# EAGLE design WS2812MATRIX (EAGLE 9.0.0)
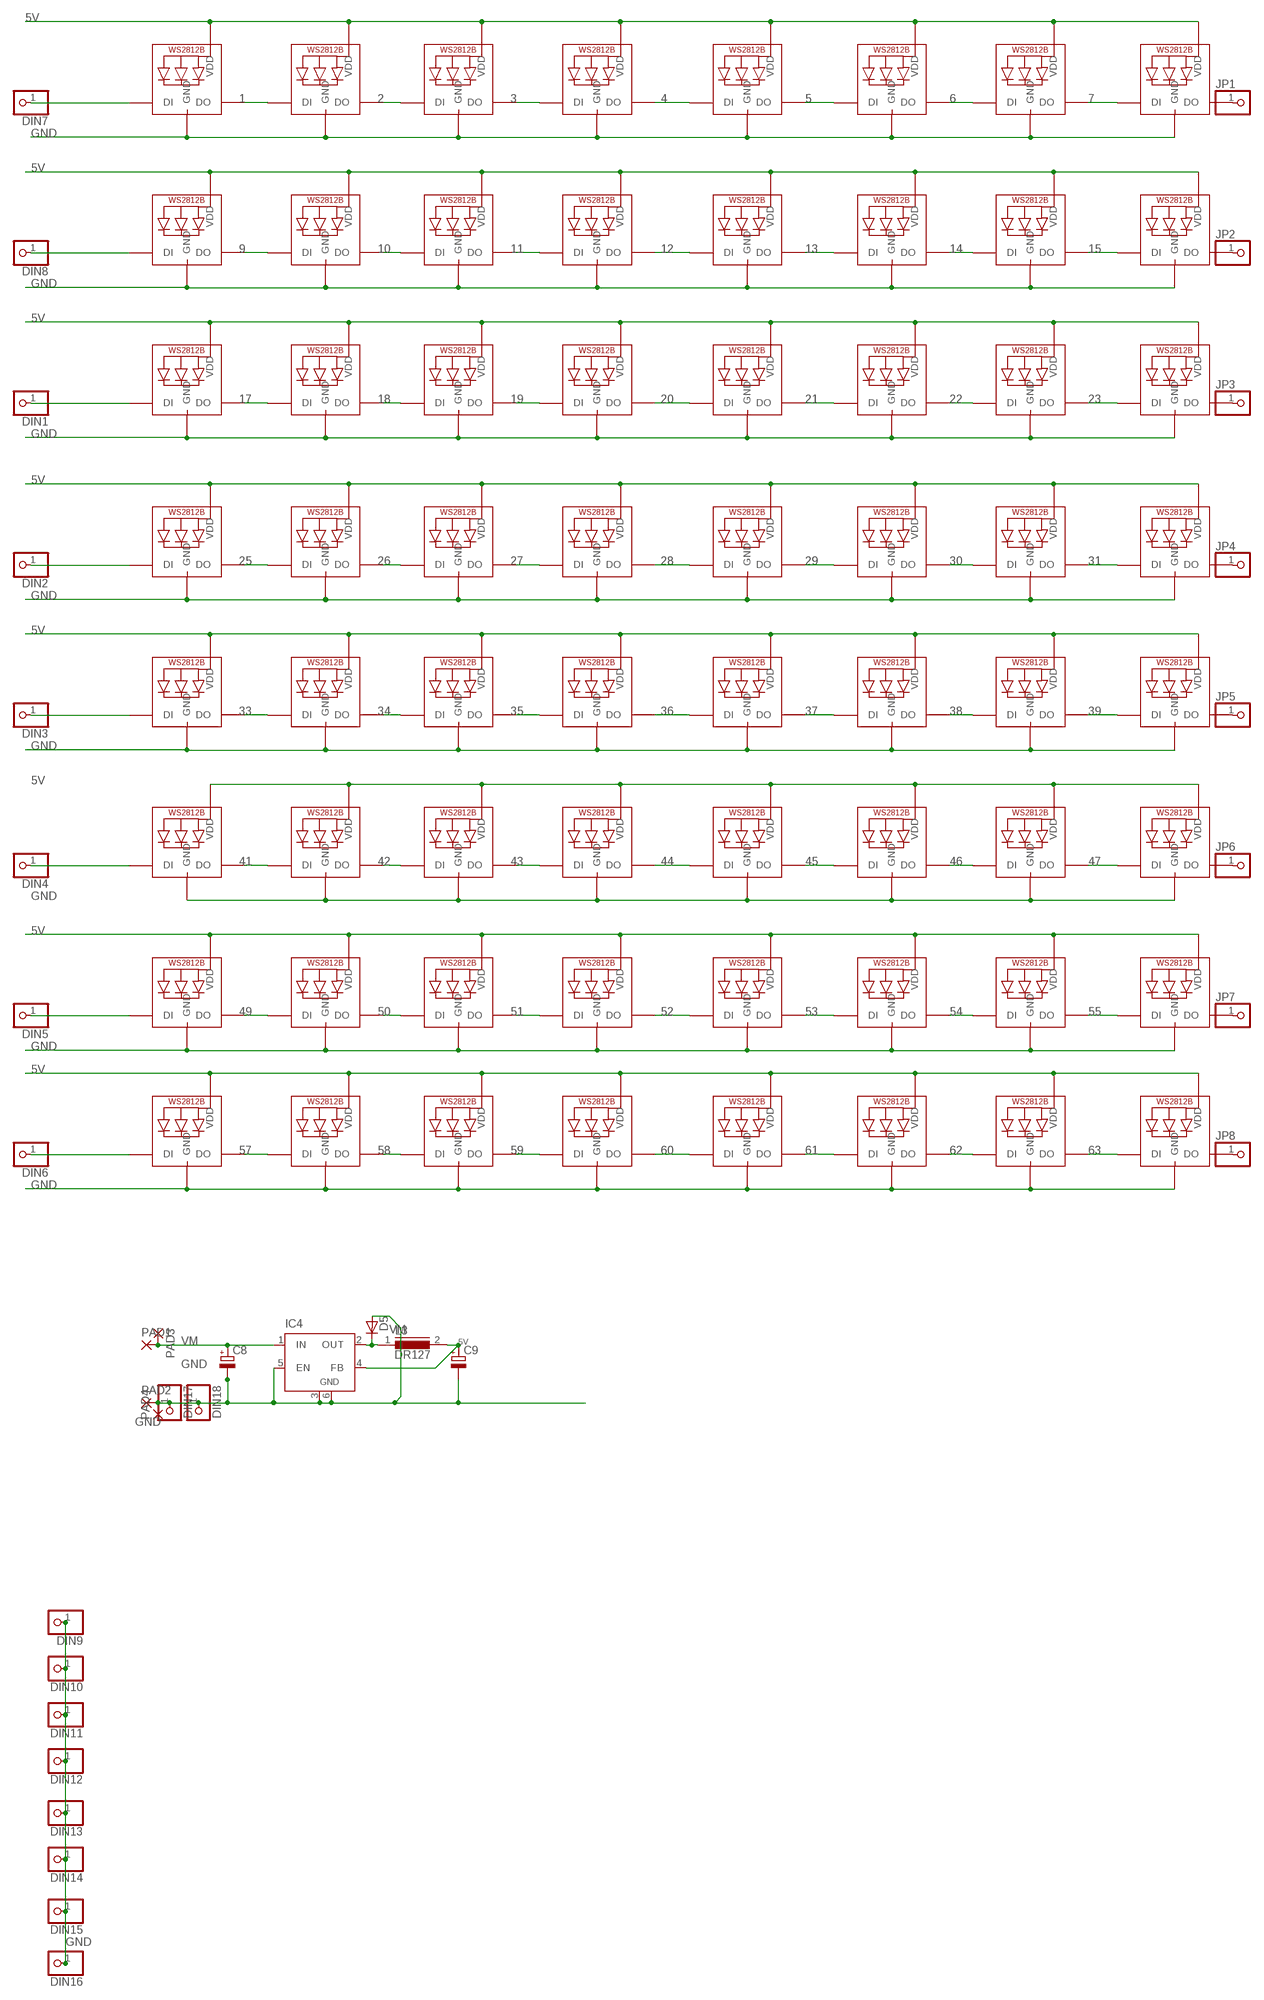
[diagram p0: schematic, sheet 1]

## Parts
C8  CPOL-EUE3.5-10  [E3,5-10]
C9  CPOL-EUE3.5-10  [E3,5-10]
D5  D-SOD-87  [SOD87]
DIN1  PINHD-1X1  [1X01]
DIN2  PINHD-1X1  [1X01]
DIN3  PINHD-1X1  [1X01]
DIN4  PINHD-1X1  [1X01]
DIN5  PINHD-1X1  [1X01]
DIN6  PINHD-1X1  [1X01]
DIN7  PINHD-1X1  [1X01]
DIN8  PINHD-1X1  [1X01]
DIN9  PINHD-1X1  [1X01]
DIN10  PINHD-1X1  [1X01]
DIN11  PINHD-1X1  [1X01]
DIN12  PINHD-1X1  [1X01]
DIN13  PINHD-1X1  [1X01]
DIN14  PINHD-1X1  [1X01]
DIN15  PINHD-1X1  [1X01]
DIN16  PINHD-1X1  [1X01]
DIN17  PINHD-1X1  [1X01]
DIN18  PINHD-1X1  [1X01]
IC4  LM2596S  [TO263-5]
JP1  PINHD-1X1  [1X01]
JP2  PINHD-1X1  [1X01]
JP3  PINHD-1X1  [1X01]
JP4  PINHD-1X1  [1X01]
JP5  PINHD-1X1  [1X01]
JP6  PINHD-1X1  [1X01]
JP7  PINHD-1X1  [1X01]
JP8  PINHD-1X1  [1X01]
L3  DR127  [DR127]
LED1  WS2812B5050  [WS2812B]
LED2  WS2812B5050  [WS2812B]
LED3  WS2812B5050  [WS2812B]
LED4  WS2812B5050  [WS2812B]
LED5  WS2812B5050  [WS2812B]
LED6  WS2812B5050  [WS2812B]
LED7  WS2812B5050  [WS2812B]
LED8  WS2812B5050  [WS2812B]
LED9  WS2812B5050  [WS2812B]
LED10  WS2812B5050  [WS2812B]
LED11  WS2812B5050  [WS2812B]
LED12  WS2812B5050  [WS2812B]
LED13  WS2812B5050  [WS2812B]
LED14  WS2812B5050  [WS2812B]
LED15  WS2812B5050  [WS2812B]
LED16  WS2812B5050  [WS2812B]
LED17  WS2812B5050  [WS2812B]
LED18  WS2812B5050  [WS2812B]
LED19  WS2812B5050  [WS2812B]
LED20  WS2812B5050  [WS2812B]
LED21  WS2812B5050  [WS2812B]
LED22  WS2812B5050  [WS2812B]
LED23  WS2812B5050  [WS2812B]
LED24  WS2812B5050  [WS2812B]
LED25  WS2812B5050  [WS2812B]
LED26  WS2812B5050  [WS2812B]
LED27  WS2812B5050  [WS2812B]
LED28  WS2812B5050  [WS2812B]
LED29  WS2812B5050  [WS2812B]
LED30  WS2812B5050  [WS2812B]
LED31  WS2812B5050  [WS2812B]
LED32  WS2812B5050  [WS2812B]
LED33  WS2812B5050  [WS2812B]
LED34  WS2812B5050  [WS2812B]
LED35  WS2812B5050  [WS2812B]
LED36  WS2812B5050  [WS2812B]
LED37  WS2812B5050  [WS2812B]
LED38  WS2812B5050  [WS2812B]
LED39  WS2812B5050  [WS2812B]
LED40  WS2812B5050  [WS2812B]
LED41  WS2812B5050  [WS2812B]
LED42  WS2812B5050  [WS2812B]
LED43  WS2812B5050  [WS2812B]
LED44  WS2812B5050  [WS2812B]
LED45  WS2812B5050  [WS2812B]
LED46  WS2812B5050  [WS2812B]
LED47  WS2812B5050  [WS2812B]
LED48  WS2812B5050  [WS2812B]
LED49  WS2812B5050  [WS2812B]
LED50  WS2812B5050  [WS2812B]
LED51  WS2812B5050  [WS2812B]
LED52  WS2812B5050  [WS2812B]
LED53  WS2812B5050  [WS2812B]
LED54  WS2812B5050  [WS2812B]
LED55  WS2812B5050  [WS2812B]
LED56  WS2812B5050  [WS2812B]
LED57  WS2812B5050  [WS2812B]
LED58  WS2812B5050  [WS2812B]
LED59  WS2812B5050  [WS2812B]
LED60  WS2812B5050  [WS2812B]
LED61  WS2812B5050  [WS2812B]
LED62  WS2812B5050  [WS2812B]
LED63  WS2812B5050  [WS2812B]
LED64  WS2812B5050  [WS2812B]
PAD1  2,54/1,1  [2,54/1,1]
PAD2  2,54/1,1  [2,54/1,1]
PAD3  2,54/1,1  [2,54/1,1]
PAD4  2,54/1,1  [2,54/1,1]

## Nets
1: LED9.2-DOUT(DO) LED10.4-DIN(DI)
2: LED10.2-DOUT(DO) LED11.4-DIN(DI)
3: LED11.2-DOUT(DO) LED12.4-DIN(DI)
4: LED12.2-DOUT(DO) LED13.4-DIN(DI)
5: LED13.2-DOUT(DO) LED14.4-DIN(DI)
5V: C9.+ IC4.4(FB) L3.2 LED1.1-VDD(VDD) LED2.1-VDD(VDD) LED3.1-VDD(VDD) LED4.1-VDD(VDD) LED5.1-VDD(VDD) LED6.1-VDD(VDD) LED7.1-VDD(VDD) LED8.1-VDD(VDD) LED9.1-VDD(VDD) LED10.1-VDD(VDD) LED11.1-VDD(VDD) LED12.1-VDD(VDD) LED13.1-VDD(VDD) LED14.1-VDD(VDD) LED15.1-VDD(VDD) LED16.1-VDD(VDD) LED17.1-VDD(VDD) LED18.1-VDD(VDD) LED19.1-VDD(VDD) LED20.1-VDD(VDD) LED21.1-VDD(VDD) LED22.1-VDD(VDD) LED23.1-VDD(VDD) LED24.1-VDD(VDD) LED25.1-VDD(VDD) LED26.1-VDD(VDD) LED27.1-VDD(VDD) LED28.1-VDD(VDD) LED29.1-VDD(VDD) LED30.1-VDD(VDD) LED31.1-VDD(VDD) LED32.1-VDD(VDD) LED33.1-VDD(VDD) LED34.1-VDD(VDD) LED35.1-VDD(VDD) LED36.1-VDD(VDD) LED37.1-VDD(VDD) LED38.1-VDD(VDD) LED39.1-VDD(VDD) LED40.1-VDD(VDD) LED41.1-VDD(VDD) LED42.1-VDD(VDD) LED43.1-VDD(VDD) LED44.1-VDD(VDD) LED45.1-VDD(VDD) LED46.1-VDD(VDD) LED47.1-VDD(VDD) LED48.1-VDD(VDD) LED49.1-VDD(VDD) LED50.1-VDD(VDD) LED51.1-VDD(VDD) LED52.1-VDD(VDD) LED53.1-VDD(VDD) LED54.1-VDD(VDD) LED55.1-VDD(VDD) LED56.1-VDD(VDD) LED57.1-VDD(VDD) LED58.1-VDD(VDD) LED59.1-VDD(VDD) LED60.1-VDD(VDD) LED61.1-VDD(VDD) LED62.1-VDD(VDD) LED63.1-VDD(VDD) LED64.1-VDD(VDD)
6: LED14.2-DOUT(DO) LED15.4-DIN(DI)
7: LED15.2-DOUT(DO) LED16.4-DIN(DI)
9: LED1.2-DOUT(DO) LED2.4-DIN(DI)
10: LED2.2-DOUT(DO) LED3.4-DIN(DI)
11: LED3.2-DOUT(DO) LED4.4-DIN(DI)
12: LED4.2-DOUT(DO) LED5.4-DIN(DI)
13: LED5.2-DOUT(DO) LED6.4-DIN(DI)
14: LED6.2-DOUT(DO) LED7.4-DIN(DI)
15: LED7.2-DOUT(DO) LED8.4-DIN(DI)
17: LED17.2-DOUT(DO) LED18.4-DIN(DI)
18: LED18.2-DOUT(DO) LED19.4-DIN(DI)
19: LED19.2-DOUT(DO) LED20.4-DIN(DI)
20: LED20.2-DOUT(DO) LED21.4-DIN(DI)
21: LED21.2-DOUT(DO) LED22.4-DIN(DI)
22: LED22.2-DOUT(DO) LED23.4-DIN(DI)
23: LED23.2-DOUT(DO) LED24.4-DIN(DI)
25: LED25.2-DOUT(DO) LED26.4-DIN(DI)
26: LED26.2-DOUT(DO) LED27.4-DIN(DI)
27: LED27.2-DOUT(DO) LED28.4-DIN(DI)
28: LED28.2-DOUT(DO) LED29.4-DIN(DI)
29: LED29.2-DOUT(DO) LED30.4-DIN(DI)
30: LED30.2-DOUT(DO) LED31.4-DIN(DI)
31: LED31.2-DOUT(DO) LED32.4-DIN(DI)
33: LED33.2-DOUT(DO) LED34.4-DIN(DI)
34: LED34.2-DOUT(DO) LED35.4-DIN(DI)
35: LED35.2-DOUT(DO) LED36.4-DIN(DI)
36: LED36.2-DOUT(DO) LED37.4-DIN(DI)
37: LED37.2-DOUT(DO) LED38.4-DIN(DI)
38: LED38.2-DOUT(DO) LED39.4-DIN(DI)
39: LED39.2-DOUT(DO) LED40.4-DIN(DI)
41: LED41.2-DOUT(DO) LED42.4-DIN(DI)
42: LED42.2-DOUT(DO) LED43.4-DIN(DI)
43: LED43.2-DOUT(DO) LED44.4-DIN(DI)
44: LED44.2-DOUT(DO) LED45.4-DIN(DI)
45: LED45.2-DOUT(DO) LED46.4-DIN(DI)
46: LED46.2-DOUT(DO) LED47.4-DIN(DI)
47: LED47.2-DOUT(DO) LED48.4-DIN(DI)
49: LED49.2-DOUT(DO) LED50.4-DIN(DI)
50: LED50.2-DOUT(DO) LED51.4-DIN(DI)
51: LED51.2-DOUT(DO) LED52.4-DIN(DI)
52: LED52.2-DOUT(DO) LED53.4-DIN(DI)
53: LED53.2-DOUT(DO) LED54.4-DIN(DI)
54: LED54.2-DOUT(DO) LED55.4-DIN(DI)
55: LED55.2-DOUT(DO) LED56.4-DIN(DI)
57: LED57.2-DOUT(DO) LED58.4-DIN(DI)
58: LED58.2-DOUT(DO) LED59.4-DIN(DI)
59: LED59.2-DOUT(DO) LED60.4-DIN(DI)
60: LED60.2-DOUT(DO) LED61.4-DIN(DI)
61: LED61.2-DOUT(DO) LED62.4-DIN(DI)
62: LED62.2-DOUT(DO) LED63.4-DIN(DI)
63: LED63.2-DOUT(DO) LED64.4-DIN(DI)
GND: C8.- C9.- D5.2(A) DIN9.1 DIN10.1 DIN11.1 DIN12.1 DIN13.1 DIN14.1 DIN15.1 DIN16.1 DIN17.1 DIN18.1 IC4.3(GND) IC4.5(EN) IC4.6(GND) LED1.3-GND(GND) LED2.3-GND(GND) LED3.3-GND(GND) LED4.3-GND(GND) LED5.3-GND(GND) LED6.3-GND(GND) LED7.3-GND(GND) LED8.3-GND(GND) LED9.3-GND(GND) LED10.3-GND(GND) LED11.3-GND(GND) LED12.3-GND(GND) LED13.3-GND(GND) LED14.3-GND(GND) LED15.3-GND(GND) LED16.3-GND(GND) LED17.3-GND(GND) LED18.3-GND(GND) LED19.3-GND(GND) LED20.3-GND(GND) LED21.3-GND(GND) LED22.3-GND(GND) LED23.3-GND(GND) LED24.3-GND(GND) LED25.3-GND(GND) LED26.3-GND(GND) LED27.3-GND(GND) LED28.3-GND(GND) LED29.3-GND(GND) LED30.3-GND(GND) LED31.3-GND(GND) LED32.3-GND(GND) LED33.3-GND(GND) LED34.3-GND(GND) LED35.3-GND(GND) LED36.3-GND(GND) LED37.3-GND(GND) LED38.3-GND(GND) LED39.3-GND(GND) LED40.3-GND(GND) LED41.3-GND(GND) LED42.3-GND(GND) LED43.3-GND(GND) LED44.3-GND(GND) LED45.3-GND(GND) LED46.3-GND(GND) LED47.3-GND(GND) LED48.3-GND(GND) LED49.3-GND(GND) LED50.3-GND(GND) LED51.3-GND(GND) LED52.3-GND(GND) LED53.3-GND(GND) LED54.3-GND(GND) LED55.3-GND(GND) LED56.3-GND(GND) LED57.3-GND(GND) LED58.3-GND(GND) LED59.3-GND(GND) LED60.3-GND(GND) LED61.3-GND(GND) LED62.3-GND(GND) LED63.3-GND(GND) LED64.3-GND(GND) PAD2.1(P) PAD4.1(P)
N$1: DIN7.1 LED9.4-DIN(DI)
N$2: DIN1.1 LED17.4-DIN(DI)
N$3: DIN2.1 LED25.4-DIN(DI)
N$4: DIN3.1 LED33.4-DIN(DI)
N$5: DIN4.1 LED41.4-DIN(DI)
N$6: DIN5.1 LED49.4-DIN(DI)
N$7: DIN6.1 LED57.4-DIN(DI)
N$8: DIN8.1 LED1.4-DIN(DI)
N$9: D5.1(C) IC4.2(OUT) L3.1
N$10: JP1.1 LED16.2-DOUT(DO)
N$11: JP2.1 LED8.2-DOUT(DO)
N$12: JP3.1 LED24.2-DOUT(DO)
N$13: JP4.1 LED32.2-DOUT(DO)
N$14: JP5.1 LED40.2-DOUT(DO)
N$15: JP6.1 LED48.2-DOUT(DO)
N$16: JP7.1 LED56.2-DOUT(DO)
N$17: JP8.1 LED64.2-DOUT(DO)
VM: C8.+ IC4.1(IN) PAD1.1(P) PAD3.1(P)

## Library data of the parts
C8 C9 = resistor:CPOL-EU: POLARIZED CAPACITOR, European symbol
D5 = semicon-smd-ipc:D-: DIODE unfilled
DIN1-DIN18 JP1-JP8 = adafruit:PINHD-1X1: Pin header 1x1 for 0.1" spacing With round pins
IC4 = linear:LM2596S: STEP-DOWN VOLTAGE REGULATOR
L3 = inductors:DR127: High Power Density, High Efficiency, Shielded Inductors Source: coiltronics_dr_series.pdf
LED1-LED64 = adafruit:WS2812B
PAD1-PAD4 = wirepad:2,54/1,1: THROUGH-HOLE PAD

## Board
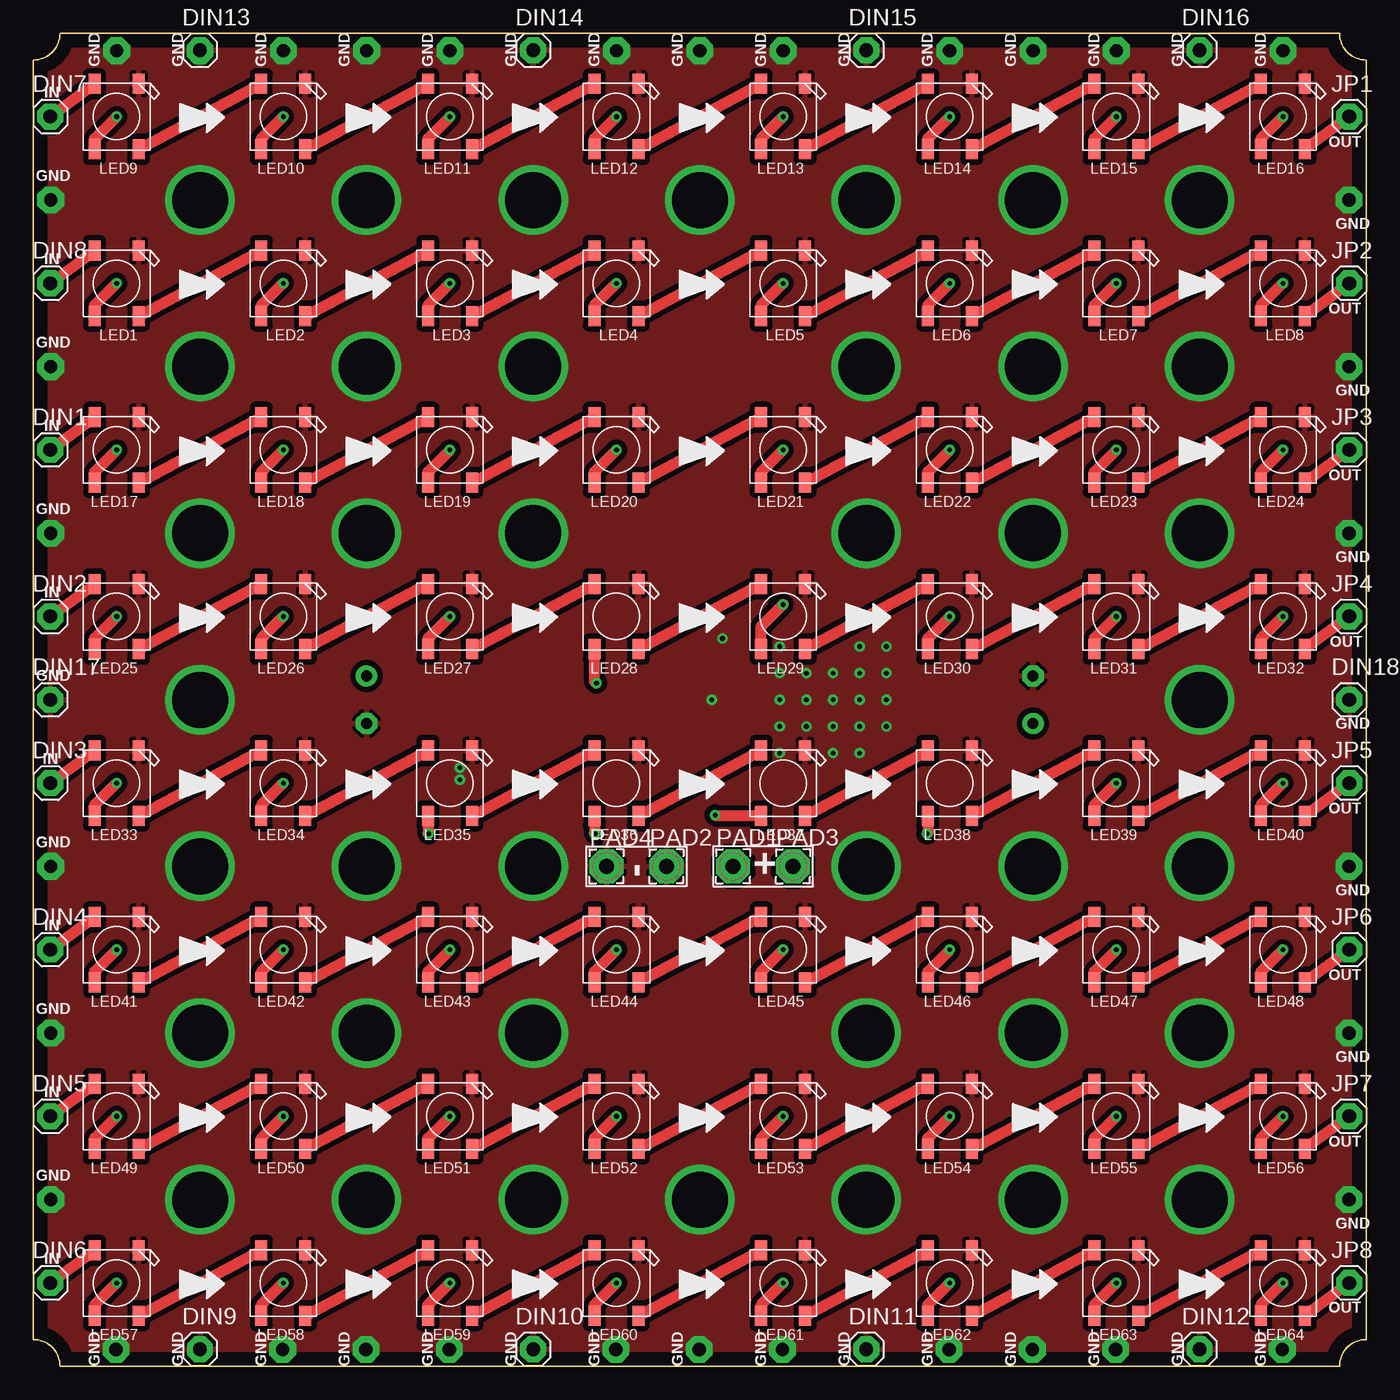
[diagram p1: board, top side]
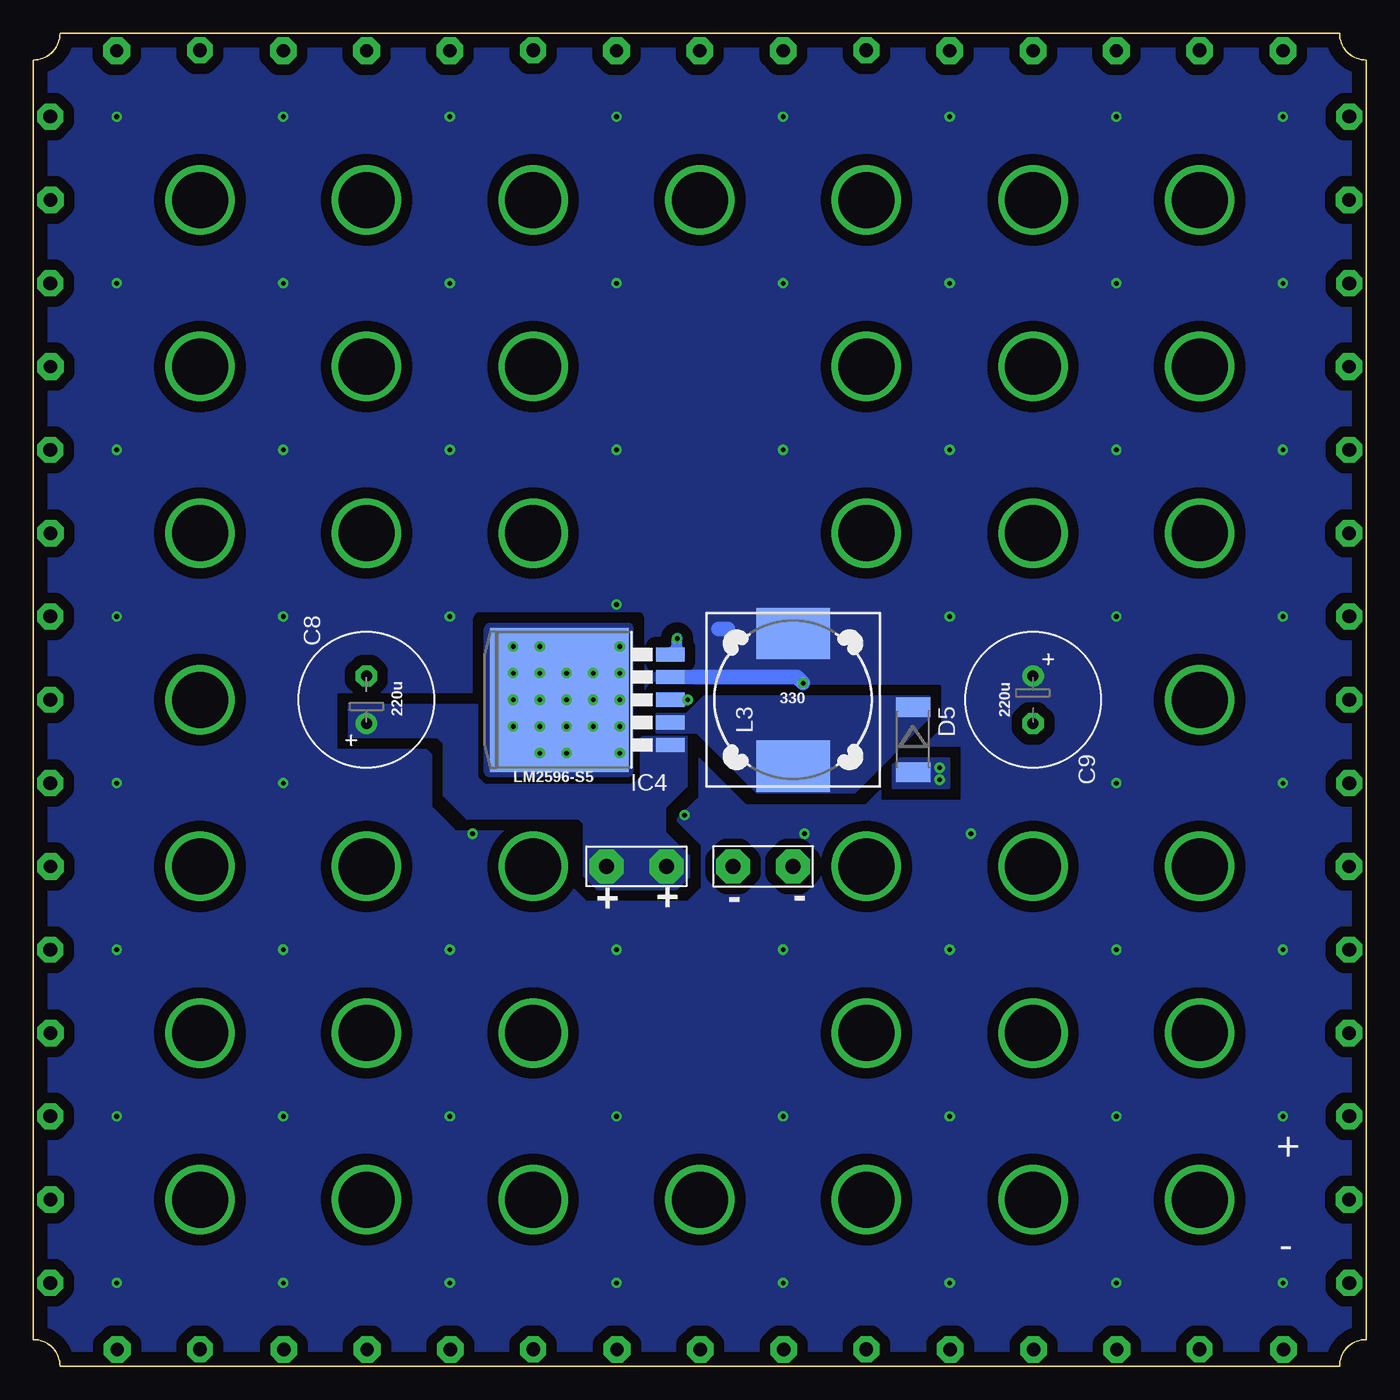
[diagram p2: board, bottom side, seen from below]

Size 100 x 100 mm. Coordinates in mm from the lower left corner, seen from the top.
Outline: 2,0 98,0 arc-90 100,2 100,98 arc-90 98,100 2,100 arc-90 0,98 0,2 arc-90 2,0
Copper layers (1*16): Top 0.035mm / dielectric 1.5mm / Bottom 0.035mm
Design rules "default": minimum track width 6mil, minimum drill 0.35mm, track to track 6mil, track to pad 6mil, pad to pad 6mil, via to via 6mil, smd to smd 6mil, copper to edge 40mil, drill to drill 6mil, minimum pad ring 10mil, minimum via ring 8mil, stop-mask expansion 4mil, vias tented up to drill 0mil, thermal gap 10mil

### Footprints (pad centres in the part's own frame; a part is rotated, then mirrored left to right if it is on the bottom)
E3,5-10 = drill 0.813 pad 1.6: + -1.778,0 | drill 0.813 pad 1.6 octagon: - 1.778,0
SOD87 = smd 1.45 x 2.6: 1 -2.445,0; 2 2.445,0
1X01 = drill 1.016 pad 1.93 octagon: 1 0,0
TO263-5 = smd 1.067 x 2.159: 1 -3.404,-5.791; 2 -1.702,-5.791; 3 0,-5.791; 4 1.702,-5.791; 5 3.404,-5.791 | smd 10.8 x 10.41: 6 0,2.54
DR127 = smd 3.85 x 5.5: 1 -4.975,0; 2 4.975,0
WS2812B = smd 1.5 x 0.9: 1-VDD 2.45,-1.65; 2-DOUT 2.45,1.65; 3-GND -2.45,1.65; 4-DIN -2.45,-1.65
2,54/1,1 = drill 1.118 pad 2.54 octagon: 1 0,0

### Placement (x,y rotation side)
C8  75,50 90 bottom
C9  25,50 270 bottom
D5  34,47 270 bottom
DIN1  1.27,68.75 0 top
DIN2  1.27,56.25 0 top
DIN3  1.27,43.75 0 top
DIN4  1.27,31.25 0 top
DIN5  1.27,18.75 0 top
DIN6  1.27,6.25 0 top
DIN7  1.27,93.75 0 top
DIN8  1.27,81.25 0 top
DIN9  12.5,1.27 0 top
DIN10  37.5,1.27 0 top
DIN11  62.5,1.27 0 top
DIN12  87.5,1.27 0 top
DIN13  12.5,98.73 0 top
DIN14  37.5,98.73 0 top
DIN15  62.5,98.73 0 top
DIN16  87.5,98.73 0 top
DIN17  1.27,50 0 top
DIN18  98.73,50 0 top
IC4  58,50 90 bottom
JP1  98.73,93.75 0 top
JP2  98.73,81.25 0 top
JP3  98.73,68.75 0 top
JP4  98.73,56.25 0 top
JP5  98.73,43.75 0 top
JP6  98.73,31.25 0 top
JP7  98.73,18.75 0 top
JP8  98.73,6.25 0 top
L3  43,50 90 bottom
LED1  6.25,81.25 270 top
LED2  18.75,81.25 270 top
LED3  31.25,81.25 270 top
LED4  43.75,81.25 270 top
LED5  56.25,81.25 270 top
LED6  68.75,81.25 270 top
LED7  81.25,81.25 270 top
LED8  93.75,81.25 270 top
LED9  6.25,93.75 270 top
LED10  18.75,93.75 270 top
LED11  31.25,93.75 270 top
LED12  43.75,93.75 270 top
LED13  56.25,93.75 270 top
LED14  68.75,93.75 270 top
LED15  81.25,93.75 270 top
LED16  93.75,93.75 270 top
LED17  6.25,68.75 270 top
LED18  18.75,68.75 270 top
LED19  31.25,68.75 270 top
LED20  43.75,68.75 270 top
LED21  56.25,68.75 270 top
LED22  68.75,68.75 270 top
LED23  81.25,68.75 270 top
LED24  93.75,68.75 270 top
LED25  6.25,56.25 270 top
LED26  18.75,56.25 270 top
LED27  31.25,56.25 270 top
LED28  43.75,56.25 270 top
LED29  56.25,56.25 270 top
LED30  68.75,56.25 270 top
LED31  81.25,56.25 270 top
LED32  93.75,56.25 270 top
LED33  6.25,43.75 270 top
LED34  18.75,43.75 270 top
LED35  31.25,43.75 270 top
LED36  43.75,43.75 270 top
LED37  56.25,43.75 270 top
LED38  68.75,43.75 270 top
LED39  81.25,43.75 270 top
LED40  93.75,43.75 270 top
LED41  6.25,31.25 270 top
LED42  18.75,31.25 270 top
LED43  31.25,31.25 270 top
LED44  43.75,31.25 270 top
LED45  56.25,31.25 270 top
LED46  68.75,31.25 270 top
LED47  81.25,31.25 270 top
LED48  93.75,31.25 270 top
LED49  6.25,18.75 270 top
LED50  18.75,18.75 270 top
LED51  31.25,18.75 270 top
LED52  43.75,18.75 270 top
LED53  56.25,18.75 270 top
LED54  68.75,18.75 270 top
LED55  81.25,18.75 270 top
LED56  93.75,18.75 270 top
LED57  6.25,6.25 270 top
LED58  18.75,6.25 270 top
LED59  31.25,6.25 270 top
LED60  43.75,6.25 270 top
LED61  56.25,6.25 270 top
LED62  68.75,6.25 270 top
LED63  81.25,6.25 270 top
LED64  93.75,6.25 270 top
PAD1  52.5,37.5 0 top
PAD2  47.5,37.5 0 top
PAD3  57,37.5 0 top
PAD4  43,37.5 0 top

### Tracks (layer width: path | path; a pad name or v marks a point on that pad's centre or on a via)
1
  Top 0.813: LED9.2-DOUT LED10.4-DIN
2
  Top 0.813: LED10.2-DOUT LED11.4-DIN
3
  Top 0.813: LED11.2-DOUT LED12.4-DIN
4
  Top 0.813: LED12.2-DOUT LED13.4-DIN
5
  Top 0.813: LED13.2-DOUT LED14.4-DIN
5V  (via drill 0.35)
  Top 0.813: LED9.1-VDD 4.6,92.1 v6.25,93.75 | LED10.1-VDD 17.1,92.1 v18.75,93.75 | LED11.1-VDD 29.6,92.1 v31.25,93.75 | LED12.1-VDD 42.1,92.1 v43.75,93.75 | LED13.1-VDD 54.6,92.1 v56.25,93.75 | LED14.1-VDD 67.1,92.1 v68.75,93.75 | LED15.1-VDD 79.6,92.1 v81.25,93.75 | LED16.1-VDD 92.1,92.1 v93.75,93.75 | LED1.1-VDD 4.6,79.6 v6.25,81.25 | LED2.1-VDD 17.1,79.6 v18.75,81.25 | LED3.1-VDD 29.6,79.6 v31.25,81.25 | LED4.1-VDD 42.1,79.6 v43.75,81.25 | LED5.1-VDD 54.6,79.6 v56.25,81.25 | LED6.1-VDD 67.1,79.6 v68.75,81.25 | LED7.1-VDD 79.6,79.6 v81.25,81.25 | LED8.1-VDD 92.1,79.6 v93.75,81.25 | LED17.1-VDD 4.6,67.1 v6.25,68.75 | LED18.1-VDD 17.1,67.1 v18.75,68.75 | LED19.1-VDD 29.6,67.1 v31.25,68.75 | LED20.1-VDD 42.1,67.1 v43.75,68.75 | LED21.1-VDD 54.6,67.1 v56.25,68.75 | LED22.1-VDD 67.1,67.1 v68.75,68.75 | LED23.1-VDD 79.6,67.1 v81.25,68.75 | LED24.1-VDD 92.1,67.1 v93.75,68.75 | LED25.1-VDD 4.6,54.6 v6.25,56.25 | LED26.1-VDD 17.1,54.6 v18.75,56.25 | LED27.1-VDD 29.6,54.6 v31.25,56.25 | LED29.1-VDD 54.6,55.5 v56.25,57.15 | LED30.1-VDD 67.1,54.6 v68.75,56.25 | LED31.1-VDD 79.6,54.6 v81.25,56.25 | LED32.1-VDD 92.1,54.6 v93.75,56.25 | LED33.1-VDD 4.6,42.1 v6.25,43.75 | LED34.1-VDD 17.1,42.1 v18.75,43.75 | LED39.1-VDD 79.6,42.1 v81.25,43.75 | LED40.1-VDD 92.1,42.1 v93.75,43.75 | LED41.1-VDD 4.6,29.6 v6.25,31.25 | LED42.1-VDD 17.1,29.6 v18.75,31.25 | LED43.1-VDD 29.6,29.6 v31.25,31.25 | LED44.1-VDD 42.1,29.6 v43.75,31.25 | LED45.1-VDD 54.6,29.6 v56.25,31.25 | LED46.1-VDD 67.1,29.6 v68.75,31.25 | LED47.1-VDD 79.6,29.6 v81.25,31.25 | LED48.1-VDD 92.1,29.6 v93.75,31.25 | LED49.1-VDD 4.6,17.1 v6.25,18.75 | LED50.1-VDD 17.1,17.1 v18.75,18.75
  Top 0.813: LED51.1-VDD 29.6,17.1 v31.25,18.75 | LED52.1-VDD 42.1,17.1 v43.75,18.75 | LED53.1-VDD 54.6,17.1 v56.25,18.75 | LED54.1-VDD 67.1,17.1 v68.75,18.75 | LED55.1-VDD 79.6,17.1 v81.25,18.75 | LED56.1-VDD 92.1,17.1 v93.75,18.75 | LED57.1-VDD 4.6,4.6 v6.25,6.25 | LED58.1-VDD 17.1,4.6 v18.75,6.25 | LED59.1-VDD 29.6,4.6 v31.25,6.25 | LED60.1-VDD 42.1,4.6 v43.75,6.25 | LED61.1-VDD 54.6,4.6 v56.25,6.25 | LED62.1-VDD 67.1,4.6 v68.75,6.25 | LED63.1-VDD 79.6,4.6 v81.25,6.25 | LED64.1-VDD 92.1,4.6 v93.75,6.25 | LED37.1-VDD 51.2,41.3 v51.15,41.35 | LED36.1-VDD 42.1,40 v42.15,39.95 | LED35.1-VDD 29.6,40 v29.65,39.95 | LED38.1-VDD 67.1,40 v67.05,39.95 | v42.25,51.25 42.1,51.4 LED28.1-VDD
  Bottom 1.1: 48.61,55.3 47.9,55.3 | IC4.4 42.7,51.7 v42.25,51.25
  pour Bottom (isolate 0.813, rank 6, no thermals): 0,100 100,100 100,0 0,0
6
  Top 0.813: LED14.2-DOUT LED15.4-DIN
7
  Top 0.813: LED15.2-DOUT LED16.4-DIN
9
  Top 0.813: LED1.2-DOUT LED2.4-DIN
10
  Top 0.813: LED2.2-DOUT LED3.4-DIN
11
  Top 0.813: LED3.2-DOUT LED4.4-DIN
12
  Top 0.813: LED4.2-DOUT LED5.4-DIN
13
  Top 0.813: LED5.2-DOUT LED6.4-DIN
14
  Top 0.813: LED6.2-DOUT LED7.4-DIN
15
  Top 0.813: LED7.2-DOUT LED8.4-DIN
17
  Top 0.813: LED17.2-DOUT LED18.4-DIN
18
  Top 0.813: LED18.2-DOUT LED19.4-DIN
19
  Top 0.813: LED19.2-DOUT LED20.4-DIN
20
  Top 0.813: LED20.2-DOUT LED21.4-DIN
21
  Top 0.813: LED21.2-DOUT LED22.4-DIN
22
  Top 0.813: LED22.2-DOUT LED23.4-DIN
23
  Top 0.813: LED23.2-DOUT LED24.4-DIN
25
  Top 0.813: LED25.2-DOUT LED26.4-DIN
26
  Top 0.813: LED27.4-DIN LED26.2-DOUT
27
  Top 0.813: LED27.2-DOUT LED28.4-DIN
28
  Top 0.813: LED28.2-DOUT LED29.4-DIN
29
  Top 0.813: LED29.2-DOUT LED30.4-DIN
30
  Top 0.813: LED30.2-DOUT LED31.4-DIN
31
  Top 0.813: LED31.2-DOUT LED32.4-DIN
33
  Top 0.813: LED33.2-DOUT LED34.4-DIN
34
  Top 0.813: LED34.2-DOUT LED35.4-DIN
35
  Top 0.813: LED35.2-DOUT LED36.4-DIN
36
  Top 0.813: LED36.2-DOUT LED37.4-DIN
37
  Top 0.813: LED37.2-DOUT LED38.4-DIN
38
  Top 0.813: LED38.2-DOUT LED39.4-DIN
39
  Top 0.813: LED39.2-DOUT LED40.4-DIN
41
  Top 0.813: LED41.2-DOUT LED42.4-DIN
42
  Top 0.813: LED42.2-DOUT LED43.4-DIN
43
  Top 0.813: LED43.2-DOUT LED44.4-DIN
44
  Top 0.813: LED45.4-DIN LED44.2-DOUT
45
  Top 0.813: LED45.2-DOUT LED46.4-DIN
46
  Top 0.813: LED46.2-DOUT LED47.4-DIN
47
  Top 0.813: LED47.2-DOUT LED48.4-DIN
49
  Top 0.813: LED49.2-DOUT LED50.4-DIN
50
  Top 0.813: LED50.2-DOUT LED51.4-DIN
51
  Top 0.813: LED51.2-DOUT LED52.4-DIN
52
  Top 0.813: LED52.2-DOUT LED53.4-DIN
53
  Top 0.813: LED53.2-DOUT LED54.4-DIN
54
  Top 0.813: LED54.2-DOUT LED55.4-DIN
55
  Top 0.813: LED55.2-DOUT LED56.4-DIN
57
  Top 0.813: LED57.2-DOUT LED58.4-DIN
58
  Top 0.813: LED58.2-DOUT LED59.4-DIN
59
  Top 0.813: LED59.2-DOUT LED60.4-DIN
60
  Top 0.813: LED60.2-DOUT LED61.4-DIN
61
  Top 0.813: LED61.2-DOUT LED62.4-DIN
62
  Top 0.813: LED62.2-DOUT LED63.4-DIN
63
  Top 0.813: LED63.2-DOUT LED64.4-DIN
GND  (via drill 0.35, 1 pad 2, 4.2 pad 5)
  Bottom 0.813: IC4.5 51.7,53.91 v51.7,54.6 | IC4.3 v50.9,50
  other vias: 87.5,50 87.5,87.5 50,87.5 12.5,87.5 12.5,50 12.5,12.5 50,12.5 87.5,12.5 58,50 60,50 62,50 64,50 56,50 58,48 60,48 62,48 62,52 60,52 58,52 56,52 56,48 56,46 60,46 62,46 64,48 64,52 62,54 64,54 56,54 32,44 32,44.9 12.5,62.5 12.5,75 12.5,37.5 12.5,25 25,12.5 37.5,12.5 62.5,12.5 75,12.5 87.5,25 87.5,37.5 87.5,62.5 87.5,75 75,87.5 62.5,87.5 37.5,87.5 25,87.5 25,75 37.5,75 62.5,75 75,75 75,62.5 62.5,62.5 37.5,62.5 25,62.5 25,25 37.5,25 62.5,25 75,25 75,37.5 62.5,37.5 37.5,37.5 25,37.5 1.3,62.5 1.3,37.5 1.3,25 1.3,12.5 1.3,75 1.3,87.5 98.7,62.5 98.7,75 98.7,87.5 98.7,37.5 98.7,25 98.7,12.5 12.5,98.69 18.75,98.69 25,98.69 31.25,98.69 43.75,98.69 50,98.69 56.25,98.69 68.75,98.69 75,98.69 81.25,98.69 93.75,98.69 6.25,98.69 6.21,1.26 18.71,1.26 24.96,1.26 31.21,1.26 43.71,1.26 49.96,1.26 56.21,1.26 68.71,1.26 74.96,1.26 81.21,1.26 93.71,1.26
  pour Top (isolate 0.406, rank 6): 0,100 100,100 100,0 0,0
  pour Bottom (isolate 0.305, no thermals): 65.7,55.4 55.4,55.4 55.4,44.6 65.8,44.6 65.8,55.3
  pour Bottom (no thermals): 31.5,43.4 35.5,43.4 35.5,45.1 35,45.6 31.3,45.6 31.3,43.4
N$1
  Top 0.813: DIN7.1 LED9.4-DIN
N$2
  Top 0.813: DIN1.1 LED17.4-DIN
N$3
  Top 0.813: DIN2.1 LED25.4-DIN
N$4
  Top 0.813: DIN3.1 LED33.4-DIN
N$5
  Top 0.813: DIN4.1 LED41.4-DIN
N$6
  Top 0.813: DIN5.1 LED49.4-DIN
N$7
  Top 0.813: DIN6.1 LED57.4-DIN
N$8
  Top 0.813: DIN8.1 LED1.4-DIN
N$9
  pour Bottom (no thermals): 53.2,47.6 50.2,47.6 45.7,43.1 38.4,43.1 32.8,48.7 32.8,50.2 49.7,50.2 51,48.9 53.2,48.9
N$10
  Top 0.813: JP1.1 LED16.2-DOUT
N$11
  Top 0.813: JP2.1 LED8.2-DOUT
N$12
  Top 0.813: JP3.1 LED24.2-DOUT
N$13
  Top 0.813: JP4.1 LED32.2-DOUT
N$14
  Top 0.813: JP5.1 LED40.2-DOUT
N$15
  Top 0.813: JP6.1 LED48.2-DOUT
N$16
  Top 0.813: JP7.1 LED56.2-DOUT
N$17
  Top 0.813: JP8.1 LED64.2-DOUT
VM
  pour Bottom (no thermals): 76.3,49.6 66.7,49.6 66.7,44.2 66.1,43.6 55,43.6 54.4,44.2 54.4,47.1 54.3,47.2 51,47.2 51,43.5 52.6,41.9 52.6,40.1 50.8,38.3 50.8,36.7 51.7,35.8 57.7,35.8 58.7,36.8 58.7,40.7 59.1,41.1 67.5,41.1 69.2,42.8 69.2,46.7 69.7,47.2 76.3,47.2

### Text on the board
tPlace: GND | GND | GND | GND | GND | GND | GND | GND | GND | GND | GND | GND | GND | GND | GND | IN | OUT | GND | GND | IN | OUT | GND | GND | IN | OUT | GND | GND | IN | OUT | GND | GND | IN | OUT | GND | - | + | GND | IN | OUT | GND | GND | IN | OUT | GND | GND | IN | OUT | GND | GND | GND | GND | GND | GND | GND | GND | GND | GND | GND | GND | GND | GND | GND
bPlace: 220u | 330 | 220u | LM2596-S5 | - | - | + | + | + | -
tStop: WS2812MATRIX | (PvdW 2018)